# Altium schematic sheet OpAmp.SchDoc
size A4; SheetNumber: 3; SheetTotal: 5
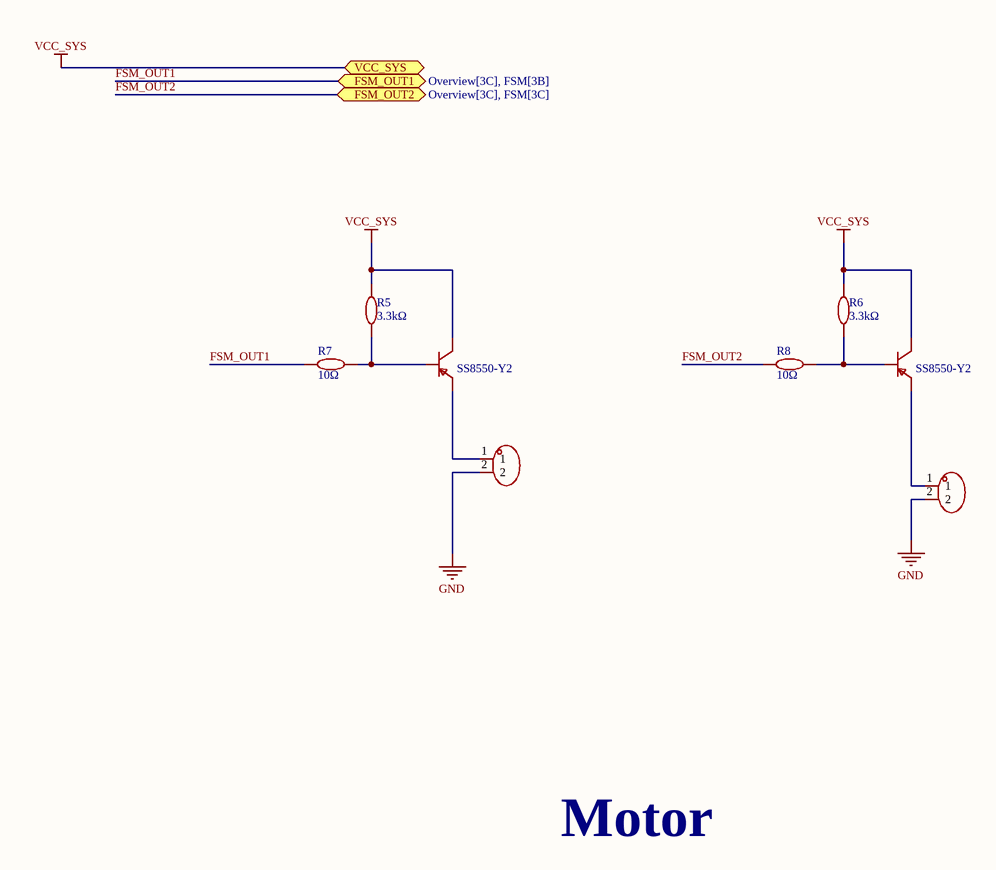
[diagram p0: OpAmp.SchDoc]

## Parts
Q1  SS8550-Y2  [SOT-23_L2.9-W1.3-P1.90-LS2.4-BR]
Q2  SS8550-Y2  [SOT-23_L2.9-W1.3-P1.90-LS2.4-BR]
R5  3.3kΩ  [R0402]
R6  3.3kΩ  [R0402]
R7  10Ω  [R0402]
R8  10Ω  [R0402]
U7  WJ500V-5.08-2P-13-00A  [CONN-TH_DB125-2.54-2P-GN]  (value not drawn)
U8  WJ500V-5.08-2P-13-00A  [CONN-TH_DB125-2.54-2P-GN]  (value not drawn)

## Ports
FSM_OUT1 (bidir, see Overview[3C], FSM[3B]), FSM_OUT2 (bidir, see Overview[3C], FSM[3C]), VCC_SYS (bidir)

## Nets
GND: U7.2 U8.2
VCC_SYS: Q1.3(C) Q2.3(C) R5.2 R6.2 ; port VCC_SYS
FSM_OUT1: R7.1 ; port FSM_OUT1
FSM_OUT2: R8.1 ; port FSM_OUT2
NetQ1_1: Q1.1(B) R5.1 R7.2
NetQ1_2: Q1.2(E) U7.1
NetQ2_1: Q2.1(B) R6.1 R8.2
NetQ2_2: Q2.2(E) U8.1

## Notes on the sheet
- Motor

## Library data of the parts
Q1 Q2 = SS8550-Y2: H档200-350 PNP 电流:1.5A 电压:25V 该 PNP 双极晶体管适用于线性和开关应用。此器件采用 SOT-23 封装，适用于低功率表面贴装应用。; Symbol: SS8550-Y2
R5 R6 = 3.3kΩ: 62.5mW 3.3kΩ 50V ±100ppm/℃ Thick Film Resistor ±1% 0402 Chip Resistor - Surface Mount ROHS
R7 R8 = 10Ω: 10Ω 62.5mW 50V ±200ppm/℃ Thick Film Resistor ±1% 0402 Chip Resistor - Surface Mount ROHS
U7 U8 = DORABO DB125-2.54-2P-GN-S: 2.54 srew terminal; Manufacturer: KANGNEX(康奈克斯电气); Add into BOM: yes; Symbol: WJ500V-5.08-2P-13-00A; Device: WJ500V-5.08-2P-13-00A; LCSC Part Name: 直插  P=5.08mm 2P 可拼接 黑色; Supplier Part: C42377752; Manufacturer Part: WJ500V-5.08-2P-13-00A; Supplier Footprint: 插件,P=5.08mm; JLCPCB Part Class: Extended Part; Datasheet: https://atta.szlcsc.com/upload/public/pdf/source/20241106/B65BE8431F64096104C016AC2C83CE18.pdf; Supplier: LCSC; Convert to PCB: yes